# EAGLE schematic arm-board-rev2 (EAGLE 6.5.0)

## Sheet 1 of 6: Processor
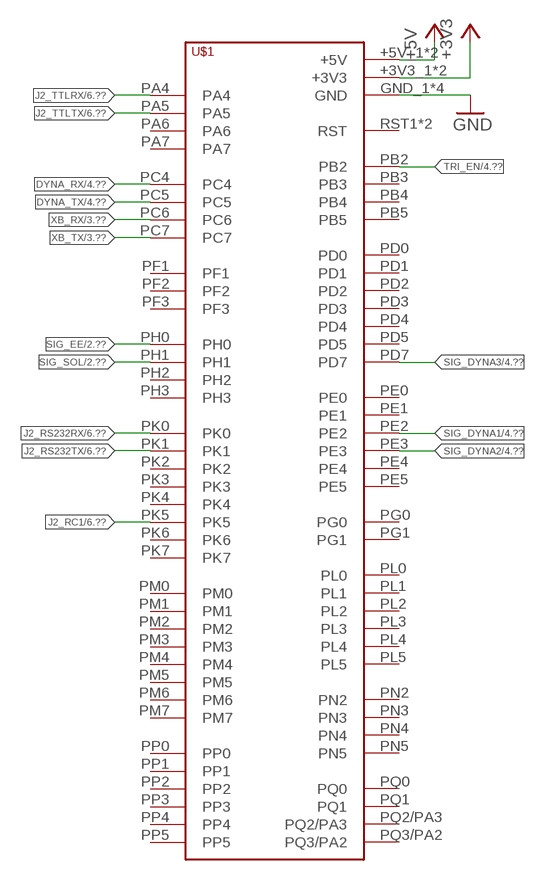
[diagram p0: schematic, sheet 1]

### Parts
U$1  TIVA-C-CONNECTED  [TIVA-C-CONNECTED]

### Nets
+3V3: U$1.+3V3_1(+3V3) U$1.+3V3_2(+3V3) ; also sheet 3
+5V: U$1.+5V_1(+5V) U$1.+5V_2(+5V) ; also sheet 2,4,5,6
DYNA_RX: U$1.PC4 ; also sheet 4
DYNA_TX: U$1.PC5 ; also sheet 4
GND: U$1.GND_1(GND) U$1.GND_2(GND) U$1.GND_3(GND) U$1.GND_4(GND) ; also sheet 2,3,4,5,6
J2_RC1: U$1.PK5 ; also sheet 6
J2_RS232RX: U$1.PK0 ; also sheet 6
J2_RS232TX: U$1.PK1 ; also sheet 6
J2_TTLRX: U$1.PA4 ; also sheet 6
J2_TTLTX: U$1.PA5 ; also sheet 6
SIG_DYNA1: U$1.PE2 ; also sheet 4
SIG_DYNA2: U$1.PE3 ; also sheet 4
SIG_DYNA3: U$1.PD7 ; also sheet 4
SIG_EE: U$1.PH0 ; also sheet 2
SIG_SOL: U$1.PH1 ; also sheet 2
TRI_EN: U$1.PB2 ; also sheet 4
XB_RX: U$1.PC6 ; also sheet 3
XB_TX: U$1.PC7 ; also sheet 3
Unconnected: U$1.PA6 U$1.PA7 U$1.PB3 U$1.PB4 U$1.PB5 U$1.PD0 U$1.PD1 U$1.PD2 U$1.PD3 U$1.PD4 U$1.PD5 U$1.PE0 U$1.PE1 U$1.PE4 U$1.PE5 U$1.PF1 U$1.PF2 U$1.PF3 U$1.PG0 U$1.PG1 U$1.PH2 U$1.PH3 U$1.PK2 U$1.PK3 U$1.PK4 U$1.PK6 U$1.PK7 U$1.PL0 U$1.PL1 U$1.PL2 U$1.PL3 U$1.PL4 U$1.PL5 U$1.PM0 U$1.PM1 U$1.PM2 U$1.PM3 U$1.PM4 U$1.PM5 U$1.PM6 U$1.PM7 U$1.PN2 U$1.PN3 U$1.PN4 U$1.PN5 U$1.PP0 U$1.PP1 U$1.PP2 U$1.PP3 U$1.PP4 U$1.PP5 U$1.PQ0 U$1.PQ1 U$1.PQ2/PA3 U$1.PQ3/PA2 U$1.RST1(RST) U$1.RST_2(RST)

## Sheet 2 of 6: Power
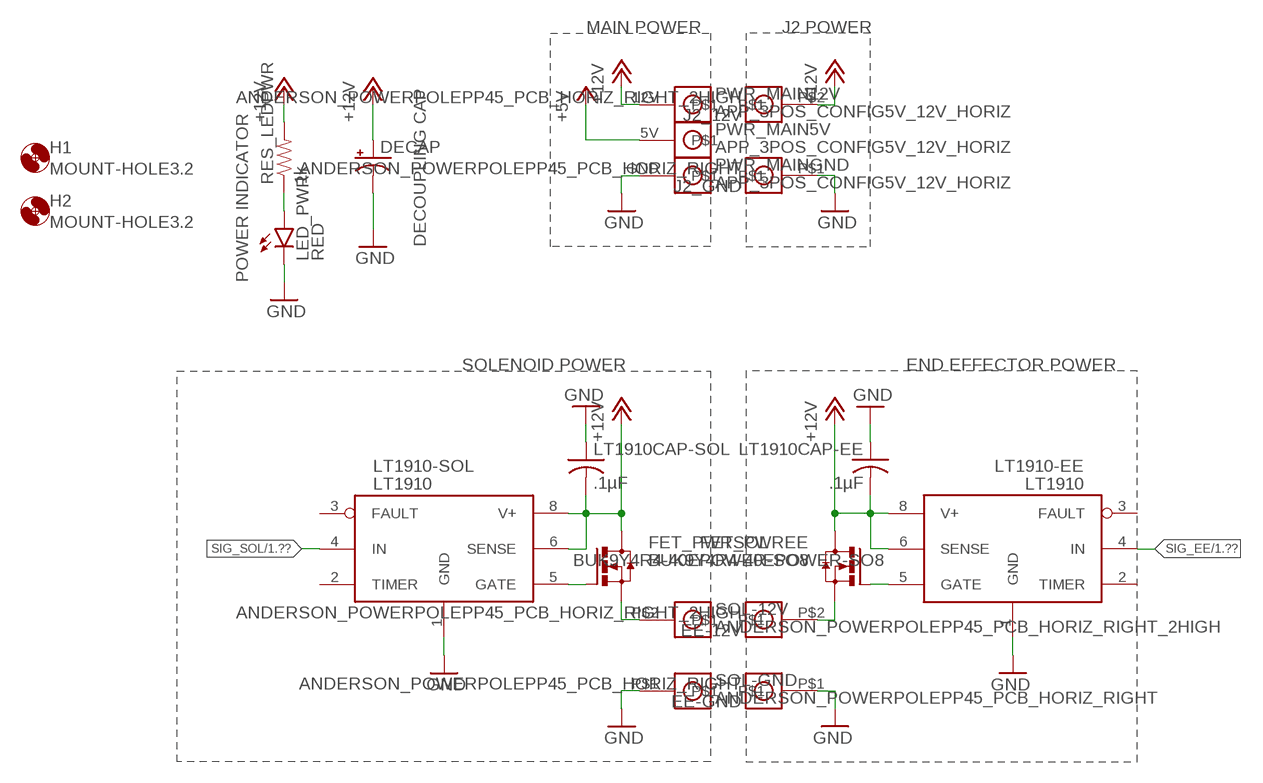
[diagram p1: schematic, sheet 2]

### Parts
DECAP  100UF-25V-20%(PTH)  [CPOL-RADIAL-100UF-25V]
EE-12V  ANDERSON_POWERPOLEPP45_PCB_HORIZ_RIGHT_2HIGH  [APP45_PCB_HORIZ_RIGHT_2HIGH]
EE-GND  ANDERSON_POWERPOLEPP45_PCB_HORIZ_RIGHT  [APP45_PCB_HORIZ_RIGHT]
FET_PWREE  BUK9Y4R4-40EPOWER-SO8  [POWER-SO8]
FET_PWRSOL  BUK9Y4R4-40EPOWER-SO8  [POWER-SO8]
H1  MOUNT-HOLE3.2  [3,2]
H2  MOUNT-HOLE3.2  [3,2]
J2_12V  ANDERSON_POWERPOLEPP45_PCB_HORIZ_RIGHT_2HIGH  [APP45_PCB_HORIZ_RIGHT_2HIGH]
J2_GND  ANDERSON_POWERPOLEPP45_PCB_HORIZ_RIGHT  [APP45_PCB_HORIZ_RIGHT]
LED_PWR  RED  LED1206  [LED-1206]
LT1910-EE  LT1910  [SO8]
LT1910-SOL  LT1910  [SO8]
LT1910CAP-EE  .1µF  C-USC1206  [C1206]
LT1910CAP-SOL  .1µF  C-USC1206  [C1206]
PWR_MAIN  APP_3POS_CONFIG5V_12V_HORIZ  [APP45_5V_12V_HORIZ_CONFIG]
RES_LEDPWR  1k  RESISTOR1206  [1206]
SOL-12V  ANDERSON_POWERPOLEPP45_PCB_HORIZ_RIGHT_2HIGH  [APP45_PCB_HORIZ_RIGHT_2HIGH]
SOL-GND  ANDERSON_POWERPOLEPP45_PCB_HORIZ_RIGHT  [APP45_PCB_HORIZ_RIGHT]

### Nets
+5V: PWR_MAIN.5V ; also sheet 1,4,5,6
+12V: DECAP.1(+) FET_PWREE.5(D) FET_PWREE.6(D) FET_PWREE.7(D) FET_PWREE.8(D) FET_PWRSOL.5(D) FET_PWRSOL.6(D) FET_PWRSOL.7(D) FET_PWRSOL.8(D) J2_12V.P$2 LT1910-EE.6(SENSE) LT1910-EE.8(V+) LT1910-SOL.6(SENSE) LT1910-SOL.8(V+) LT1910CAP-EE.2 LT1910CAP-SOL.2 PWR_MAIN.12V RES_LEDPWR.2 ; also sheet 4
GATE-EE: LT1910-EE.5(GATE)
GATE-SOL: LT1910-SOL.5(GATE)
GND: DECAP.2(-) EE-GND.P$1 J2_GND.P$1 LED_PWR.C LT1910-EE.1(GND) LT1910-SOL.1(GND) LT1910CAP-EE.1 LT1910CAP-SOL.1 PWR_MAIN.GND SOL-GND.P$1 ; also sheet 1,3,4,5,6
N$4: LED_PWR.A RES_LEDPWR.1
SIG_EE: LT1910-EE.4(IN) ; also sheet 1
SIG_SOL: LT1910-SOL.4(IN) ; also sheet 1
SOURCE-EE: EE-12V.P$2 FET_PWREE.1(S) FET_PWREE.2(S) FET_PWREE.3(S)
SOURCE-SOL: FET_PWRSOL.1(S) FET_PWRSOL.2(S) FET_PWRSOL.3(S) SOL-12V.P$2
Unconnected: FET_PWREE.4(G) FET_PWRSOL.4(G) LT1910-EE.2(TIMER) LT1910-EE.3(FAULT) LT1910-SOL.2(TIMER) LT1910-SOL.3(FAULT)

### Notes on the sheet
- MAIN POWER | J2 POWER
- DECOUPLING CAP
- POWER INDICATOR
- SOLENOID POWER | END EFFECTOR POWER

## Sheet 3 of 6: Xbee
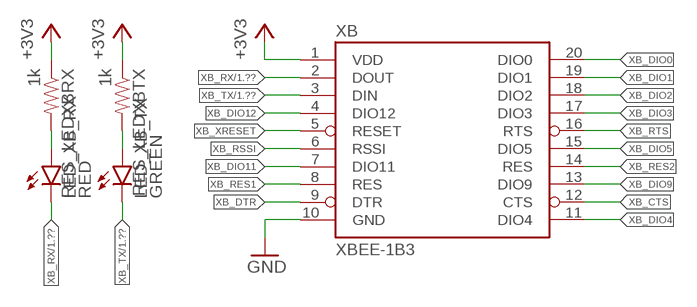
[diagram p2: schematic, sheet 3]

### Parts
LED_XB_RX  RED  LED1206  [LED-1206]
LED_XB_TX  GREEN  LED-GREEN1206  [LED-1206]
RES_LEDXBRX  1k  RESISTOR1206  [1206]
RES_LEDXBTX  1k  RESISTOR1206  [1206]
XB  XBEE-1B3  [XBEE-SMD]

### Nets
+3V3: RES_LEDXBRX.1 RES_LEDXBTX.1 XB.1(VDD) ; also sheet 1
GND: XB.10(GND) ; also sheet 1,2,4,5,6
N$1: LED_XB_RX.A RES_LEDXBRX.2
N$2: LED_XB_TX.A RES_LEDXBTX.2
XB_CTS: XB.12(CTS)
XB_DIO0: XB.20(DIO0)
XB_DIO1: XB.19(DIO1)
XB_DIO2: XB.18(DIO2)
XB_DIO3: XB.17(DIO3)
XB_DIO4: XB.11(DIO4)
XB_DIO5: XB.15(DIO5)
XB_DIO9: XB.13(DIO9)
XB_DIO11: XB.7(DIO11)
XB_DIO12: XB.4(DIO12)
XB_DTR: XB.9(DTR)
XB_RES1: XB.8(RES)
XB_RES2: XB.14(RES)
XB_RSSI: XB.6(RSSI)
XB_RTS: XB.16(RTS)
XB_RX: LED_XB_RX.C XB.2(DOUT) ; also sheet 1
XB_TX: LED_XB_TX.C XB.3(DIN) ; also sheet 1
XB_XRESET: XB.5(RESET)

## Sheet 4 of 6: Dynamixels
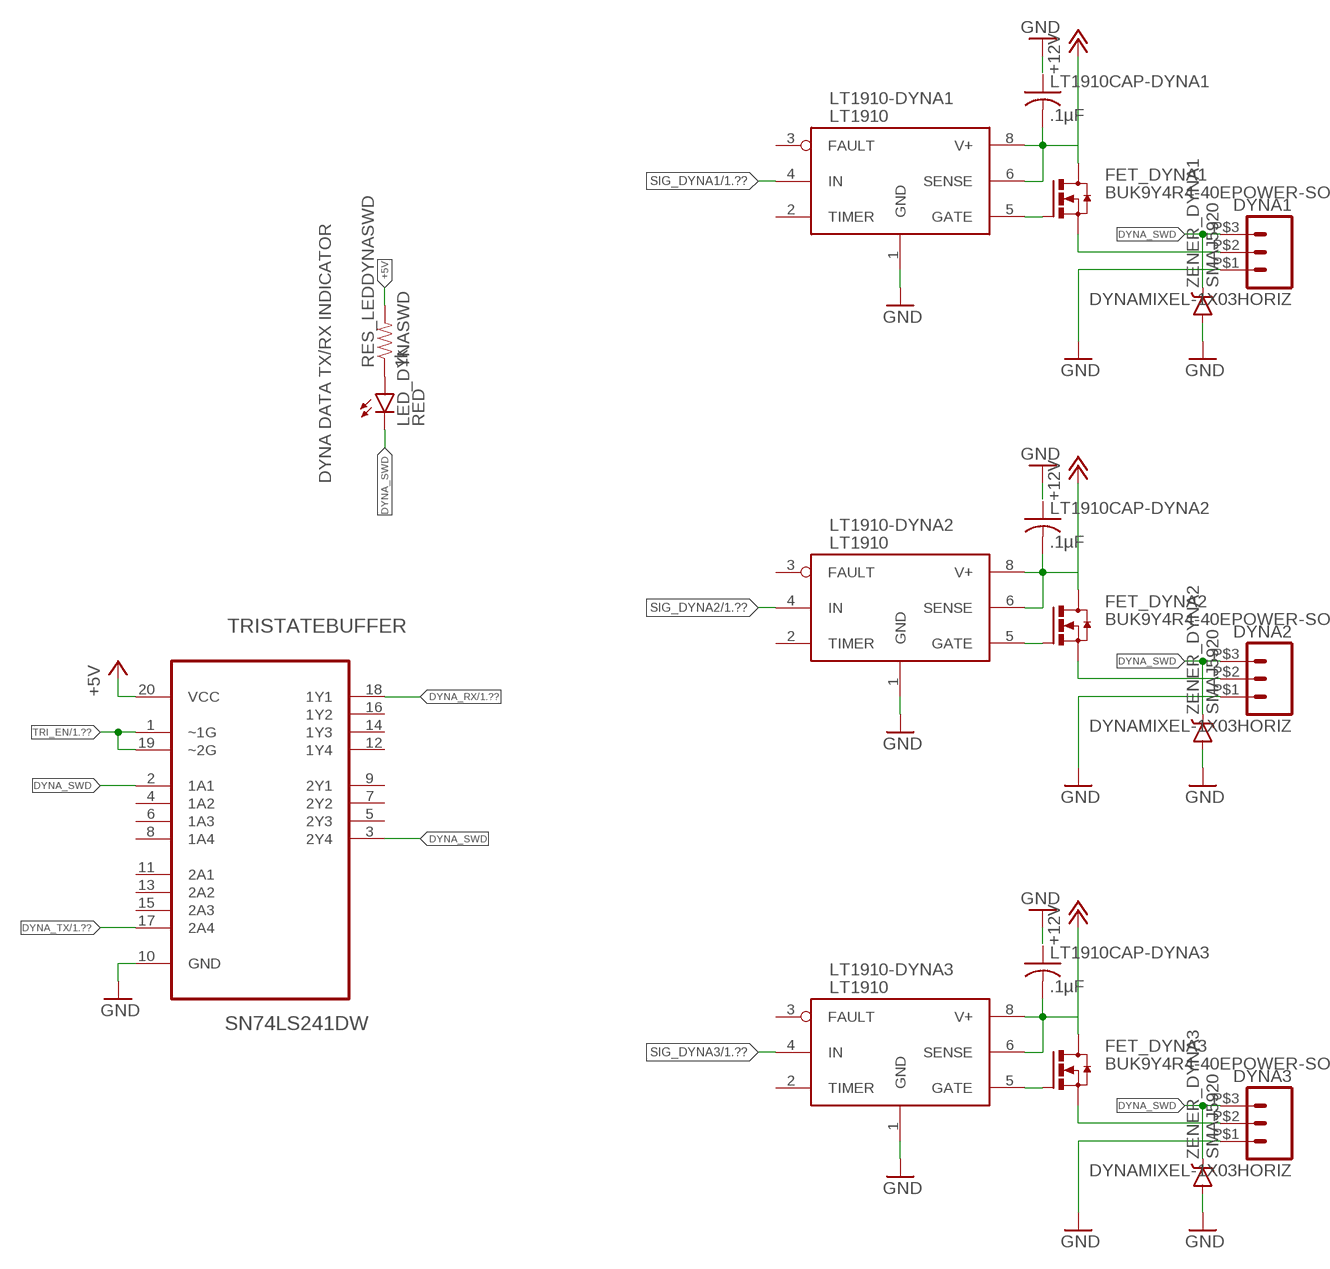
[diagram p3: schematic, sheet 4]

### Parts
DYNA1  DYNAMIXEL-1X03HORIZ  [MLX-SPOX5268-3PIN]
DYNA2  DYNAMIXEL-1X03HORIZ  [MLX-SPOX5268-3PIN]
DYNA3  DYNAMIXEL-1X03HORIZ  [MLX-SPOX5268-3PIN]
FET_DYNA1  BUK9Y4R4-40EPOWER-SO8  [POWER-SO8]
FET_DYNA2  BUK9Y4R4-40EPOWER-SO8  [POWER-SO8]
FET_DYNA3  BUK9Y4R4-40EPOWER-SO8  [POWER-SO8]
LED_DYNASWD  RED  LED1206  [LED-1206]
LT1910-DYNA1  LT1910  [SO8]
LT1910-DYNA2  LT1910  [SO8]
LT1910-DYNA3  LT1910  [SO8]
LT1910CAP-DYNA1  .1µF  C-USC1206  [C1206]
LT1910CAP-DYNA2  .1µF  C-USC1206  [C1206]
LT1910CAP-DYNA3  .1µF  C-USC1206  [C1206]
RES_LEDDYNASWD  1k  RESISTOR1206  [1206]
TRISTATEBUFFER  SN74LS241DW  [SOIC127P1030X265-20N]
ZENER_DYNA1  SMAJ5920  DIODE-SCHOTTKY-MBRA140  [SMA-DIODE]
ZENER_DYNA2  SMAJ5920  DIODE-SCHOTTKY-MBRA140  [SMA-DIODE]
ZENER_DYNA3  SMAJ5920  DIODE-SCHOTTKY-MBRA140  [SMA-DIODE]

### Nets
+5V: RES_LEDDYNASWD.2 TRISTATEBUFFER.20(VCC) ; also sheet 1,2,5,6
+12V: FET_DYNA1.5(D) FET_DYNA1.6(D) FET_DYNA1.7(D) FET_DYNA1.8(D) FET_DYNA2.5(D) FET_DYNA2.6(D) FET_DYNA2.7(D) FET_DYNA2.8(D) FET_DYNA3.5(D) FET_DYNA3.6(D) FET_DYNA3.7(D) FET_DYNA3.8(D) LT1910-DYNA1.6(SENSE) LT1910-DYNA1.8(V+) LT1910-DYNA2.6(SENSE) LT1910-DYNA2.8(V+) LT1910-DYNA3.6(SENSE) LT1910-DYNA3.8(V+) LT1910CAP-DYNA1.2 LT1910CAP-DYNA2.2 LT1910CAP-DYNA3.2 ; also sheet 2
DYNA_RX: TRISTATEBUFFER.18(1Y1) ; also sheet 1
DYNA_SWD: DYNA1.P$3 DYNA2.P$3 DYNA3.P$3 LED_DYNASWD.C TRISTATEBUFFER.2(1A1) TRISTATEBUFFER.3(2Y4) ZENER_DYNA1.C ZENER_DYNA2.C ZENER_DYNA3.C
DYNA_TX: TRISTATEBUFFER.17(2A4) ; also sheet 1
GATE-DYNA1: LT1910-DYNA1.5(GATE)
GATE-DYNA2: LT1910-DYNA2.5(GATE)
GATE-DYNA3: LT1910-DYNA3.5(GATE)
GND: DYNA1.P$1 DYNA2.P$1 DYNA3.P$1 LT1910-DYNA1.1(GND) LT1910-DYNA2.1(GND) LT1910-DYNA3.1(GND) TRISTATEBUFFER.10(GND) ZENER_DYNA1.A ZENER_DYNA2.A ZENER_DYNA3.A ; also sheet 1,2,3,5,6
N$3: LED_DYNASWD.A RES_LEDDYNASWD.1
SIG_DYNA1: LT1910-DYNA1.4(IN) ; also sheet 1
SIG_DYNA2: LT1910-DYNA2.4(IN) ; also sheet 1
SIG_DYNA3: LT1910-DYNA3.4(IN) ; also sheet 1
SOURCE-DYNA1: DYNA1.P$2 FET_DYNA1.1(S) FET_DYNA1.2(S) FET_DYNA1.3(S)
SOURCE-DYNA2: DYNA2.P$2 FET_DYNA2.1(S) FET_DYNA2.2(S) FET_DYNA2.3(S)
SOURCE-DYNA3: DYNA3.P$2 FET_DYNA3.1(S) FET_DYNA3.2(S) FET_DYNA3.3(S)
TRI_EN: TRISTATEBUFFER.1(~1G) TRISTATEBUFFER.19(~2G) ; also sheet 1
Unconnected: FET_DYNA1.4(G) FET_DYNA2.4(G) FET_DYNA3.4(G) LT1910-DYNA1.2(TIMER) LT1910-DYNA1.3(FAULT) LT1910-DYNA2.2(TIMER) LT1910-DYNA2.3(FAULT) LT1910-DYNA3.2(TIMER) LT1910-DYNA3.3(FAULT) LT1910CAP-DYNA1.1 LT1910CAP-DYNA2.1 LT1910CAP-DYNA3.1 TRISTATEBUFFER.4(1A2) TRISTATEBUFFER.5(2Y3) TRISTATEBUFFER.6(1A3) TRISTATEBUFFER.7(2Y2) TRISTATEBUFFER.8(1A4) TRISTATEBUFFER.9(2Y1) TRISTATEBUFFER.11(2A1) TRISTATEBUFFER.12(1Y4) TRISTATEBUFFER.13(2A2) TRISTATEBUFFER.14(1Y3) TRISTATEBUFFER.15(2A3) TRISTATEBUFFER.16(1Y2)

### Notes on the sheet
- DYNA DATA TX/RX INDICATOR

## Sheet 5 of 6: Encoders
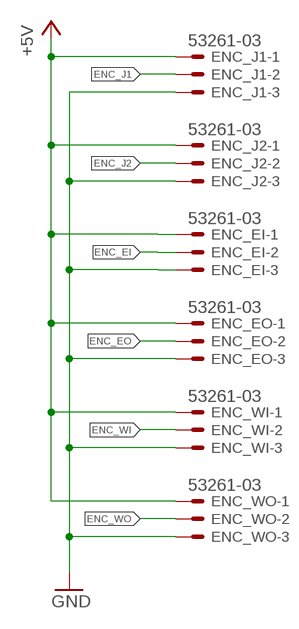
[diagram p4: schematic, sheet 5]

### Parts
ENC_EI  53261-03  [53261-03]
ENC_EO  53261-03  [53261-03]
ENC_J1  53261-03  [53261-03]
ENC_J2  53261-03  [53261-03]
ENC_WI  53261-03  [53261-03]
ENC_WO  53261-03  [53261-03]

### Nets
+5V: ENC_EI.1 ENC_EO.1 ENC_J1.1 ENC_J2.1 ENC_WI.1 ENC_WO.1 ; also sheet 1,2,4,6
ENC_EI: ENC_EI.2
ENC_EO: ENC_EO.2
ENC_J1: ENC_J1.2
ENC_J2: ENC_J2.2
ENC_WI: ENC_WI.2
ENC_WO: ENC_WO.2
GND: ENC_EI.3 ENC_EO.3 ENC_J1.3 ENC_J2.3 ENC_WI.3 ENC_WO.3 ; also sheet 1,2,3,4,6

## Sheet 6 of 6: J2
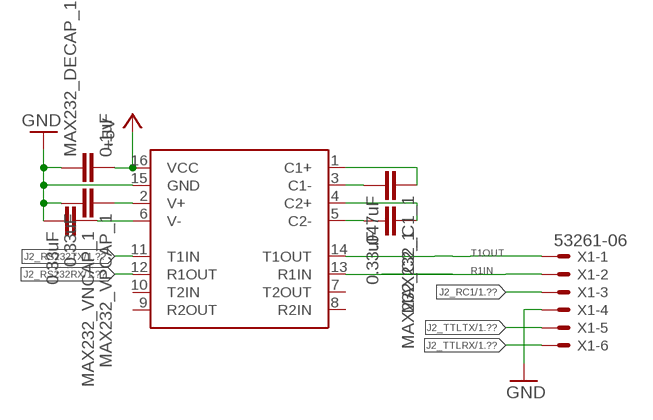
[diagram p5: schematic, sheet 6]

### Parts
MAX232_1  MAX3232SO16  [SO16]
MAX232_C1_1  .047uF  CAP1206  [1206]
MAX232_C2_1  0.33uF  CAP1206  [1206]
MAX232_DECAP_1  0.1uF  CAP1206  [1206]
MAX232_VNCAP_1  0.33uF  CAP1206  [1206]
MAX232_VPCAP_1  0.33uF  CAP1206  [1206]
X1  53261-06  [53261-06]

### Nets
+5V: MAX232_1.16(VCC) MAX232_DECAP_1.2 ; also sheet 1,2,4,5
GND: MAX232_1.15(GND) MAX232_DECAP_1.1 MAX232_VNCAP_1.2 MAX232_VPCAP_1.2 X1.4 ; also sheet 1,2,3,4,5
J2_RC1: X1.3 ; also sheet 1
J2_RS232RX: MAX232_1.12(R1OUT) ; also sheet 1
J2_RS232TX: MAX232_1.11(T1IN) ; also sheet 1
J2_TTLRX: X1.6 ; also sheet 1
J2_TTLTX: X1.5 ; also sheet 1
N$1_1: MAX232_1.1(C1+) MAX232_C1_1.1
N$2_1: MAX232_1.2(V+) MAX232_VPCAP_1.1
N$3_1: MAX232_1.3(C1-) MAX232_C1_1.2
N$4_1: MAX232_1.4(C2+) MAX232_C2_1.1
N$5_1: MAX232_1.5(C2-) MAX232_C2_1.2
N$6_1: MAX232_1.6(V-) MAX232_VNCAP_1.1
R1IN: MAX232_1.13(R1IN) X1.2
T1OUT: MAX232_1.14(T1OUT) X1.1
Unconnected: MAX232_1.7(T2OUT) MAX232_1.8(R2IN) MAX232_1.9(R2OUT) MAX232_1.10(T2IN)

## Library data of the parts
DECAP = SparkFun-Capacitors:100UF-25V-20%(PTH): CAP-08439; PROD_ID: CAP-08439
DYNA1-DYNA3 = MRDT-2015-Arm:DYNAMIXEL-1X03; MFR: Molex; MFR_PN: 0022057035; ORIENT: Horiz
EE-12V EE-GND J2_12V J2_GND SOL-12V SOL-GND = MRDT-Connectors:ANDERSON_POWERPOLE: http://www.powerwerx.com/anderson-powerpoles/
ENC_EI ENC_EO ENC_J1 ENC_J2 ENC_WI ENC_WO = con-molex:53?-03: CONNECTOR wire to board 1.25 mm (.049 inch) pitch header; MF: MOLEX; MPN: 53261-0390; OC_FARNELL: 1125359; OC_NEWARK: 57H5006
FET_DYNA1-FET_DYNA3 FET_PWREE FET_PWRSOL = MRDT-2015-General:BUK9Y4R4-40E; MFR: NXP; MFR_PN: BUK9Y4R4-40E; PACKAGE: POWER-SO8
H1 H2 = holes:MOUNT-HOLE: MOUNTING HOLE with drill center marker
LED_DYNASWD LED_PWR LED_XB_RX = SparkFun-LED:LED: LEDs Standard schematic elements and footprints for 5mm, 3mm, 1206, and 0603 sized LEDs. 5mm - Spark Fun Electronics SKU : COM-00529 (and others)
LED_XB_TX = SparkFun-LED:LED-GREEN: Various green LEDs Green LEDs used in SFE Production 0603- DIO-00821 LARGE- DIO-00862 LILYPAD- DIO-09910; PROD_ID: DIO-00862
LT1910-DYNA1-LT1910-DYNA3 LT1910-EE LT1910-SOL = Jake:LT1910
LT1910CAP-DYNA1-LT1910CAP-DYNA3 LT1910CAP-EE LT1910CAP-SOL = resistor:C-US: CAPACITOR, American symbol
MAX232_1 = MRDT-Digital-ICs:MAX3232: MAX3232 RS232 Transceiver http://pdfserv.maximintegrated.com/en/ds/MAX3222-MAX3241.pdf
MAX232_C1_1 MAX232_C2_1 MAX232_DECAP_1 MAX232_VNCAP_1 MAX232_VPCAP_1 = SparkFun-Capacitors:CAP: Capacitor Standard 0603 ceramic capacitor, and 0.1" leaded capacitor.
PWR_MAIN = MRDT-Connectors:APP_3POS_CONFIG; COLOR1: YELLOW; COLOR2: RED; COLOR3: BLACK
RES_LEDDYNASWD = SparkFun-Resistors:RESISTOR: Resistor Basic schematic elements and footprints for 0603, 1206, and PTH resistors.
RES_LEDPWR RES_LEDXBRX RES_LEDXBTX = SparkFun-Passives:RESISTOR: Resistor Basic schematic elements and footprints for 0603, 1206, and PTH resistors.
TRISTATEBUFFER = 74LS241:SN74LS241DW: OCTAL BUFFERS AND LINE DRIVERS WITH 3-STATE OUTPUTS; MPN: SN74LS241DW; OC_FARNELL: 1739687; OC_NEWARK: 50R6539; PACKAGE: SOIC-20; SUPPLIER: Texas Instruments
U$1 = MRDT-2015-General:TIVA-C-CONNECTED: TIVA C CONNECTED LAUNCHPAD
X1 = con-molex:53?-06: CONNECTOR wire to board 1.25 mm (.049 inch) pitch header; OC_FARNELL: 1125375; OC_NEWARK: unknown
XB = SparkFun:XBEE-1
ZENER_DYNA1-ZENER_DYNA3 = SparkFun-DiscreteSemi:DIODE-SCHOTTKY: Schottky diodes in SFE's production catalog BAT20J 1A 23V 0.62Vf RB751 120mA 40V 0.37Vf PMEG4005EJ 0.5A 40V 0.42Vf MBRA140 1A 40V 0.5Vf B340A 3A 40V SMA; PROD_ID: DIO-08053; VALUE: MBRA140